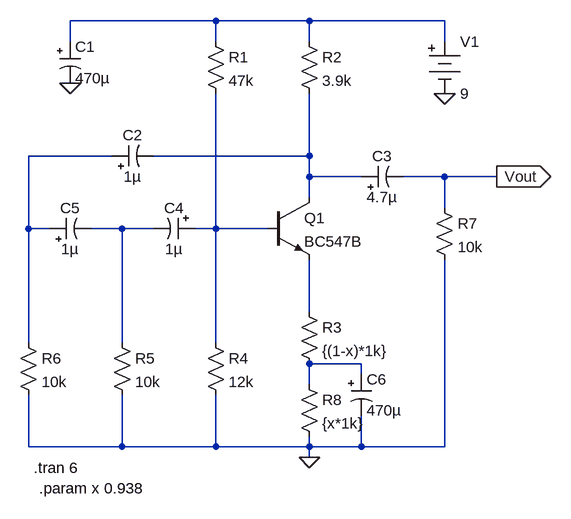
[diagram p0: schematic Draft22.asc]
Draft22.asc, the LTspice schematic file:
Version 4
SHEET 1 880 832
WIRE 320 96 96 96
WIRE 464 96 320 96
WIRE 672 96 464 96
WIRE 96 128 96 96
WIRE 320 128 320 96
WIRE 464 128 464 96
WIRE 672 128 672 96
WIRE 160 304 32 304
WIRE 464 304 464 208
WIRE 464 304 224 304
WIRE 464 336 464 304
WIRE 544 336 464 336
WIRE 672 336 608 336
WIRE 752 336 672 336
WIRE 464 368 464 336
WIRE 672 384 672 336
WIRE 32 416 32 304
WIRE 64 416 32 416
WIRE 176 416 128 416
WIRE 224 416 176 416
WIRE 320 416 320 208
WIRE 320 416 288 416
WIRE 400 416 320 416
WIRE 464 544 464 464
WIRE 32 592 32 416
WIRE 176 592 176 416
WIRE 320 592 320 416
WIRE 544 624 464 624
WIRE 544 640 544 624
WIRE 464 656 464 624
WIRE 32 752 32 672
WIRE 176 752 176 672
WIRE 176 752 32 752
WIRE 320 752 320 672
WIRE 320 752 176 752
WIRE 464 752 464 736
WIRE 464 752 320 752
WIRE 544 752 544 704
WIRE 544 752 464 752
WIRE 672 752 672 464
WIRE 672 752 544 752
WIRE 464 768 464 752
FLAG 464 768 0
FLAG 96 192 0
FLAG 672 208 0
FLAG 752 336 Vout
IOPIN 752 336 Out
SYMBOL res 304 112 R0
SYMATTR InstName R1
SYMATTR Value 47k
SYMBOL res 448 112 R0
SYMATTR InstName R2
SYMATTR Value 3.9k
SYMBOL npn 400 368 R0
SYMATTR InstName Q1
SYMATTR Value BC547B
SYMBOL res 448 528 R0
SYMATTR InstName R3
SYMATTR Value {(1-x)*1k}
SYMBOL res 304 576 R0
SYMATTR InstName R4
SYMATTR Value 12k
SYMBOL res 160 576 R0
SYMATTR InstName R5
SYMATTR Value 10k
SYMBOL res 16 576 R0
SYMATTR InstName R6
SYMATTR Value 10k
SYMBOL res 656 368 R0
SYMATTR InstName R7
SYMATTR Value 10k
SYMBOL polcap 80 128 R0
SYMATTR InstName C1
SYMATTR Value 470µ
SYMBOL polcap 160 320 R270
WINDOW 0 32 32 VTop 2
WINDOW 3 0 32 VBottom 2
SYMATTR InstName C2
SYMATTR Value 1µ
SYMBOL polcap 544 352 R270
WINDOW 0 32 32 VTop 2
WINDOW 3 0 32 VBottom 2
SYMATTR InstName C3
SYMATTR Value 4.7µ
SYMBOL polcap 288 400 R90
WINDOW 0 0 32 VBottom 2
WINDOW 3 32 32 VTop 2
SYMATTR InstName C4
SYMATTR Value 1µ
SYMBOL polcap 64 432 R270
WINDOW 0 32 32 VTop 2
WINDOW 3 0 32 VBottom 2
SYMATTR InstName C5
SYMATTR Value 1µ
SYMBOL polcap 528 640 R0
SYMATTR InstName C6
SYMATTR Value 470µ
SYMBOL Misc/battery 672 112 R0
SYMATTR InstName V1
SYMATTR Value 9
SYMBOL res 448 640 R0
SYMATTR InstName R8
SYMATTR Value {x*1k}
TEXT 40 784 Left 2 !.tran 6
TEXT 48 816 Left 2 !.param x 0.938

The netlist it stands for:
* Draft22.asc
R1 N001 N005 47k
R2 N001 N003 3.9k
Q1 N003 N005 N006 0 BC547B
R3 N006 N007 {(1-x)*1k}
R4 N005 0 12k
R5 N004 0 10k
R6 N002 0 10k
R7 Vout 0 10k
C1 N001 0 470µ
C2 N002 N003 1µ
C3 N003 Vout 4.7µ
C4 N005 N004 1µ
C5 N002 N004 1µ
C6 N007 0 470µ
V1 N001 0 9
R8 N007 0 {x*1k}
.model NPN NPN
.model PNP PNP
.lib standard.bjt
.tran 6
.param x 0.938
.backanno
.end